# Altium schematic sheet Quasar_ARM_схема.SchDoc
size A4
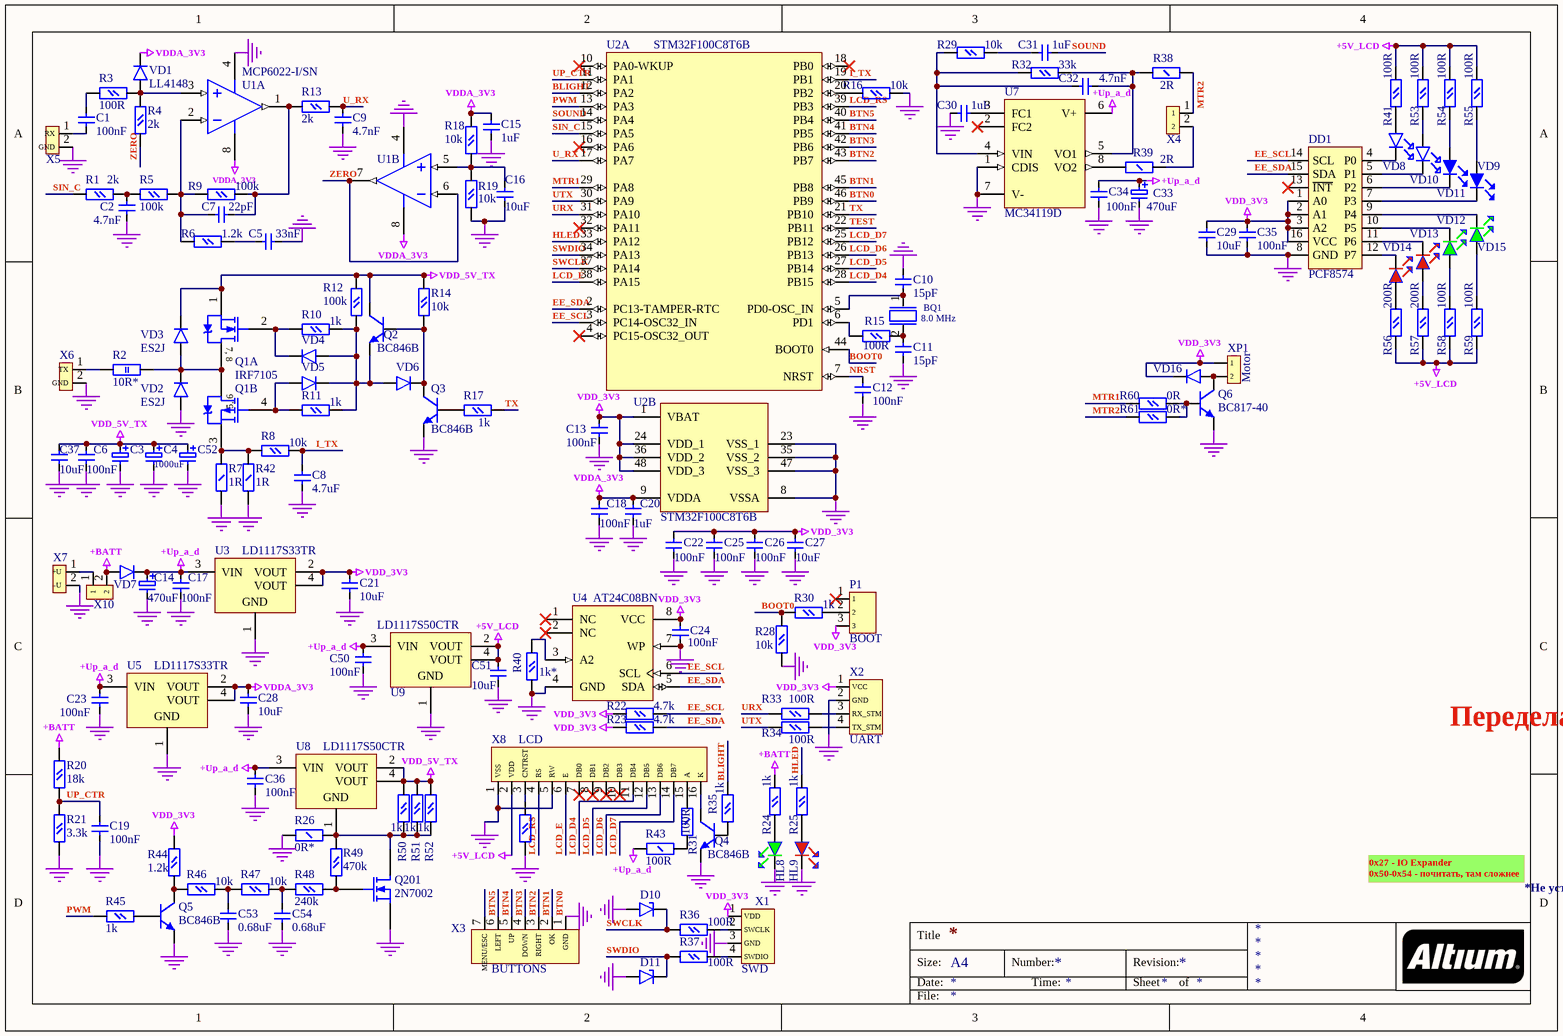
[diagram p0: Quasar_ARM_схема.SchDoc]

## Parts
BQ1  8.0 MHz  [Quartz_SMD_2pin]
C1  100nF  [0603_CAP_0.9_CL10A]
C2  4.7nF  [0603_CAP_0.9_CL10A]
C3  1000uF  [CAP-D]  (value not drawn)
C4  1000uF  [CAP-D]
C5  33nF  [0603_CAP_0.9_CL10A]
C6  100nF  [0603_CAP_0.9_CL10A]
C7  22pF  [0603_CAP_0.9_CL10A]
C8  4.7uF  [0603_CAP_0.9_CL10A]
C9  4.7nF  [0603_CAP_0.9_CL10A]
C10  15pF  [0603_CAP_0.9_CL10A]
C11  15pF  [0603_CAP_0.9_CL10A]
C12  100nF  [0603_CAP_0.9_CL10A]
C13  100nF  [0603_CAP_0.9_CL10A]
C14  470uF  [CAP-D]
C15  1uF  [0603_CAP_0.9_CL10A]
C16  10uF  [1206_C_1.8_CL31B]
C17  100nF  [0603_CAP_0.9_CL10A]
C18  100nF  [0603_CAP_0.9_CL10A]
C19  100nF  [0603_CAP_0.9_CL10A]
C20  1uF  [0603_CAP_0.9_CL10A]
C21  10uF  [1206_C_1.8_CL31B]
C22  100nF  [0603_CAP_0.9_CL10A]
C23  100nF  [0603_CAP_0.9_CL10A]
C24  100nF  [0603_CAP_0.9_CL10A]
C25  100nF  [0603_CAP_0.9_CL10A]
C26  100nF  [0603_CAP_0.9_CL10A]
C27  10uF  [1206_C_1.8_CL31B]
C28  10uF  [1206_C_1.8_CL31B]
C29  10uF  [1206_C_1.8_CL31B]
C30  1uF  [0603_CAP_0.9_CL10A]
C31  1uF  [0603_CAP_0.9_CL10A]
C32  4.7nF  [0603_CAP_0.9_CL10A]
C33  470uF  [CAP-D]
C34  100nF  [0603_CAP_0.9_CL10A]
C35  100nF  [0603_CAP_0.9_CL10A]
C36  100nF  [0603_CAP_0.9_CL10A]
C37  10uF  [1206_C_1.8_CL31B]
C50  100nF  [0603_CAP_0.9_CL10A]
C51  10uF  [1206_C_1.8_CL31B]
C52  1000uF  [CAP-D]  (value not drawn)
C53  0.68uF  [0603_CAP_0.9_CL10A]
C54  0.68uF  [0603_CAP_0.9_CL10A]
D10  BZX384-C5V1  [0402]  (value not drawn)
D11  BZX384-C5V1  [0402]  (value not drawn)
DD1  PCF8574  [SOIC127P1030X265-16N]
HL8  GNL-0603GC  [0603]  (value not drawn)
HL9  KT-SMD0603-R  [1206]  (value not drawn)
P1  BOOT  [3pin(2.54mm)]
Q1  IRF7105  [SO-8_N]  (parts A,B of 2)
Q2  BC846B  [SOT-416]
Q3  BC846B  [SOT-416]
Q4  BC846B  [SOT-416]
Q5  BC846B  [SOT-416]
Q6  BC817-40  [SOT-416]
Q201  2N7002  [SOT23]
R1  2k  [0603_R]
R2  10R*  [R_THT_2W_9x3.2x12.7]
R3  100R  [0603_R]
R4  2k  [0603_R]
R5  100k  [0603_R]
R6  1.2k  [0603_R]
R7  1R  [1206_R]
R8  10k  [0603_R]
R9  100k  [0603_R]
R10  1k  [0603_R]
R11  1k  [0603_R]
R12  100k  [0603_R]
R13  2k  [0603_R]
R14  10k  [0603_R]
R15  100R  [0603_R]
R16  10k  [0603_R]
R17  1k  [0603_R]
R18  10k  [0603_R]
R19  10k  [0603_R]
R20  18k  [0603_R]
R21  3.3k  [0603_R]
R22  4.7k  [0603_R]
R23  4.7k  [0603_R]
R24  1k  [0603_R]
R25  1k  [0603_R]
R26  0R*  [1206_R]
R27  10k-contrast  [0603_R]  (value not drawn)
R28  10k  [0603_R]
R29  10k  [0603_R]
R30  1k  [0603_R]
R31  100R  [1206_R]
R32  33k  [0603_R]
R33  100R  [0603_R]
R34  100R  [0603_R]
R35  1k  [0603_R]
R36  100R  [0603_R]
R37  100R  [0603_R]
R38  2R  [1206_R]
R39  2R  [1206_R]
R40  1k*  [0603_R]
R41  100R  [0603_R]
R42  1R  [1206_R]
R43  100R  [1206_R]
R44  1.2k  [0603_R]
R45  1k  [0603_R]
R46  10k  [0603_R]
R47  10k  [0603_R]
R48  240k  [0603_R]
R49  470k  [0603_R]
R50  1k  [0603_R]
R51  1k  [0603_R]
R52  1k  [0603_R]
R53  100R  [0603_R]
R54  100R  [0603_R]
R55  100R  [0603_R]
R56  200R  [0603_R]
R57  200R  [0603_R]
R58  100R  [0603_R]
R59  100R  [0603_R]
R60  0R  [0603_R]
R61  0R*  [0603_R]
U1  MCP6022-I/SN  [SOIC-SN8_N]  (parts A,B of 2)
U2  STM32F100C8T6B  [LQFP48_N]  (parts A,B of 2)
U3  LD1117S33TR  [SOT-223_N]
U4  AT24C08BN  [8S1_N]
U5  LD1117S33TR  [SOT-223_N]
U7  MC34119D  [751-03_N]
U8  LD1117S50CTR  [SOT-223_N]
U9  LD1117S50CTR  [SOT-223_N]
VD1  LL4148  [SOD-123FL]
VD2  ES2J  [SOD-123FL]
VD3  ES2J  [SOD-123FL]
VD4  LL4148  [SOD-123FL]  (value not drawn)
VD5  LL4148  [SOD-123FL]  (value not drawn)
VD6  LL4148  [SOD-123FL]  (value not drawn)
VD7  PMEG4010BEA  [SOD-123FL]  (value not drawn)
VD8  GNL-5013UWC/60  [LED_DIP_5mm]  (value not drawn)
VD9  GNL-5013UBW-D  [LED_DIP_5mm]  (value not drawn)
VD10  GNL-5013UWC/60  [LED_DIP_5mm]  (value not drawn)
VD11  GNL-5013UBW-D  [LED_DIP_5mm]  (value not drawn)
VD12  GNL-5013PGW-D  [0603]  (value not drawn)
VD13  GNL-5013UEW-D  [1206]  (value not drawn)
VD14  GNL-5013UEW-D  [1206]  (value not drawn)
VD15  GNL-5013PGW-D  [0603]  (value not drawn)
VD16  LL4148  [SOD-123FL]  (value not drawn)
X1  SWD  [4pin(2.54mm)]
X2  UART  [4pin(2.54mm)]
X3  BUTTONS  [7pin(2.54mm)]
X4  *  [2pin(2.54mm)]  (value not drawn)
X5  *  [2pin(2.54mm)]  (value not drawn)
X6  *  [2pin(2.54mm)]  (value not drawn)
X7  *  [2pin(2.54mm)]  (value not drawn)
X8  LCD  [16pin(2.54mm)]
X10  *  [2pin(2.54mm)]  (value not drawn)
XP1  Motor  [2pin(2.54mm)]

## Nets
+5V_LCD: C51.1 R41.2 R53.2 R54.2 R55.2 R56.1 R57.1 R58.1 R59.1 U9.2(VOUT) U9.4(VOUT) X8.2(VDD)
+BATT: R20.2 R24.1 VD7.1(ANODE) X10.2
+Up_a_d: C14.1 C17.1 C23.1 C33.1 C34.1 C36.1 C50.1 R43.2 U3.3(VIN) U5.3(VIN) U7.6(V+) U8.3(VIN) U9.3(VIN) VD7.2(CATODE1)
GND: C2.1 C3.2 C4.2 C5.1 C6.1 C8.2 C9.1 C10.1 C11.2 C12.2 C13.2 C14.2 C15.1 C16.2 C17.2 C18.2 C19.2 C20.1 C21.2 C22.2 C23.2 C24.2 C25.2 C26.2 C27.2 C28.2 C29.2 C30.1 C33.2 C34.2 C35.2 C36.2 C37.2 C50.2 C51.2 C52.2 C53.2 C54.2 D10.2(ANODE) D11.2(ANODE) DD1.8(GND) HL8.2(CATODE1) HL9.2(CATODE1) Q3.2(E) Q4.2(E) Q5.2(E) Q6.2(E) Q201.2(S) R7.2 R16.1 R19.2 R21.1 R26.1 R27.2 R28.2 R40.2 R42.2 U1.4(VSS) U2.8(VSSA) U2.23(VSS_1) U2.35(VSS_2) U2.47(VSS_3) U3.1(GND) U4.4(GND) U4.7(WP) U5.1(GND) U7.1(CDIS) U7.7(V-) U9.1(GND) VD2.1(ANODE) X1.3(GND) X2.2(GND) X3.1(GND) X5.2(GND) X6.2(GND) X7.2(-U) X8.1(VSS) X8.5(RW)
VDD_3V3: C13.1 C21.1 C22.1 C24.1 C25.1 C26.1 C27.1 C29.1 C35.1 DD1.1(A0) DD1.2(A1) DD1.3(A2) DD1.16(VCC) P1.3 R22.2 R23.2 R44.2 U2.1(VBAT) U2.24(VDD_1) U2.36(VDD_2) U2.48(VDD_3) U3.2(VOUT) U3.4(VOUT) U4.8(VCC) VD16.2(CATODE1) X1.1(VDD) X2.1(VCC) XP1.1
VDD_5V_TX: C3.1 C4.1 C6.2 C37.1 C52.1 Q1.1(S1) Q2.3(C) R12.1 R14.1 R50.1 R51.1 R52.1 U8.2(VOUT) U8.4(VOUT) VD3.2(CATODE1)
VDDA_3V3: C15.2 C18.1 C20.2 C28.1 R18.1 U1.8(VDD) U2.9(VDDA) U5.2(VOUT) U5.4(VOUT) VD1.2(CATODE1)
BLIGHT: R35.1 U2.12(PA2)
BOOT0: R28.1 R30.2 U2.44(BOOT0)
BTN0: U2.46(PB9) X3.2(OK)
BTN1: U2.45(PB8) X3.3(RIGHT)
BTN2: U2.43(PB7) X3.4(DOWN)
BTN3: U2.42(PB6) X3.5(UP)
BTN4: U2.41(PB5) X3.6(LEFT)
BTN5: U2.40(PB4) X3.7(MENU/ESC)
EE_SCL: DD1.14(SCL) R22.1 U2.3(PC14-OSC32_IN) U4.6(SCL)
EE_SDA: DD1.15(SDA) R23.1 U2.2(PC13-TAMPER-RTC) U4.5(SDA)
HLED: R25.1 U2.33(PA12)
I_TX: C8.1 R8.1 U2.19(PB1)
LCD_D4: U2.28(PB15) X8.11(DB4)
LCD_D5: U2.27(PB14) X8.12(DB5)
LCD_D6: U2.26(PB13) X8.13(DB6)
LCD_D7: U2.25(PB12) X8.14(DB7)
LCD_E: U2.38(PA15) X8.6(E)
LCD_RS: U2.39(PB3) X8.4(RS)
MTR1: R60.2 U2.29(PA8)
MTR2: R38.2 R61.2 X4.1
NRST: C12.1 U2.7(NRST)
PWM: R45.1 U2.13(PA3)
SIN_C: R1.2 U2.15(PA5)
SOUND: C31.2 U2.14(PA4)
SWCLK: D10.1(CATODE) R36.2 U2.37(PA14)
SWDIO: D11.1(CATODE) R37.2 U2.34(PA13)
TEST: U2.22(PB11)
TX: R17.2 U2.21(PB10)
U_RX: C9.2 R13.2 U2.17(PA7)
UP_CTR: C19.1 R20.1 R21.2 U2.11(PA1)
URX: R33.1 U2.31(PA10)
UTX: R34.2 U2.30(PA9)
ZERO: R4.2 U1.6(VINB-) U1.7(VOUTB)
NetBQ1_1: BQ1.1 C10.2 U2.5(PD0-OSC_IN)
NetBQ1_2: BQ1.2 C11.1 R15.2
NetC1_1: C1.1 R3.2
NetC1_2: C1.2 X5.1(RX)
NetC2_2: C2.2 R1.1 R5.2
NetC5_2: C5.2 R6.2
NetC7_1: C7.1 R5.1 R6.1 R9.2 U1.2(VINA-)
NetC7_2: C7.2 R9.1 R13.1 U1.1(VOUTA)
NetC16_1: C16.1 R18.2 R19.1 U1.5(VINB+)
NetC30_2: C30.2 U7.3(FC1)
NetC31_1: C31.1 R29.2
NetC32_1: C32.1 R29.1 R32.2 U7.4(VIN)
NetC32_2: C32.2 R32.1 R38.1 U7.5(VO1)
NetC53_1: C53.1 R46.2 R47.1
NetC54_1: C54.1 R47.2 R48.2
NetDD1_4: DD1.4(P0) VD8.1(CATODE)
NetDD1_5: DD1.5(P1) VD10.1(CATODE)
NetDD1_6: DD1.6(P2) VD11.1(CATODE)
NetDD1_7: DD1.7(P3) VD9.1(CATODE)
NetDD1_9: DD1.9(P4) VD15.1(CATODE)
NetDD1_10: DD1.10(P5) VD12.1(CATODE)
NetDD1_11: DD1.11(P6) VD13.1(CATODE)
NetDD1_12: DD1.12(P7) VD14.1(CATODE)
NetHL8_1: HL8.1(ANODE) R24.2
NetHL9_1: HL9.1(ANODE) R25.2
NetP1_2: P1.2 R30.1
NetQ1_2: Q1.2(G1) R10.2 VD4.2(CATODE1)
NetQ1_3: Q1.3(S2) R7.1 R8.2 R42.1
NetQ1_4: Q1.4(G2) R11.2 VD5.1(ANODE)
NetQ1_5: Q1.5(D2) Q1.6(D2) Q1.7(D1) Q1.8(D1) R2.2 VD2.2(CATODE1) VD3.1(ANODE)
NetQ2_1: Q2.1(B) Q3.3(C) R14.2 VD6.2(CATODE1)
NetQ2_2: Q2.2(E) R10.1 R11.1 R12.2 VD4.1(ANODE) VD5.2(CATODE1) VD6.1(ANODE)
NetQ3_1: Q3.1(B) R17.1
NetQ4_1: Q4.1(B) R35.2
NetQ4_3: Q4.3(C) X8.16(K)
NetQ5_1: Q5.1(B) R45.2
NetQ5_3: Q5.3(C) R44.1 R46.1
NetQ6_1: Q6.1(B) R60.1 R61.1
NetQ6_3: Q6.3(C) VD16.1(ANODE) XP1.2
NetQ201_1: Q201.1(D) R26.2 R49.1 R50.2 R51.2 R52.2 U8.1(GND)
NetQ201_3: Q201.3(G) R48.1 R49.2
NetR2_1: R2.1 X6.1(TX)
NetR3_1: R3.1 R4.1 U1.3(VINA+) VD1.1(ANODE)
NetR15_1: R15.1 U2.6(PD1)
NetR16_2: R16.2 U2.20(PB2)
NetR27_1: R27.1 X8.3(CNTRST)
NetR31_1: R31.1 X8.15(A)
NetR31_2: R31.2 R43.1
NetR33_2: R33.2 X2.3(RX_STM)
NetR34_1: R34.1 X2.4(TX_STM)
NetR36_1: R36.1 X1.2(SWCLK)
NetR37_1: R37.1 X1.4(SWDIO)
NetR39_1: R39.1 U7.8(VO2)
NetR39_2: R39.2 X4.2
NetR40_1: R40.1 U4.3(A2)
NetR41_1: R41.1 VD8.2(ANODE)
NetR53_1: R53.1 VD10.2(ANODE)
NetR54_1: R54.1 VD11.2(ANODE)
NetR55_1: R55.1 VD9.2(ANODE)
NetR56_2: R56.2 VD14.2(ANODE)
NetR57_2: R57.2 VD13.2(ANODE)
NetR58_2: R58.2 VD12.2(ANODE)
NetR59_2: R59.2 VD15.2(ANODE)
NetX7_1: X7.1(+U) X10.1

Not connected (* = marked no-connect by the designer): DD1 13(~{INT})*; P1 1*; U2 4(PC15-OSC32_OUT)* 10(PA0-WKUP)* 16(PA6)* 18(PB0)* 32(PA11)*; U4 1(NC)* 2(NC)*; U7 2(FC2)*; X8 7(DB0)* 8(DB1)* 9(DB2)* 10(DB3)*

## Notes on the sheet
- Переделать усилители, добавить FM
- 0x27 - IO Expander
  0x50-0x54 - почитать, там сложнее
- *Не устанавливать
- Title
- Size:
- Date:
- A4
- Number:
- Time:
- Revision:
- Sheet
- of
- File:
- (in symbol IRF7105, part A) 7, 8
- (in symbol IRF7105, part B) 5, 6

## Library data of the parts
BQ1 = Quartz_2pin: Name: 49S-SMD 8.0 MHz; Value: 8.0 MHz
C1 C6 C12 C13 C17-C19 C22-C26 C34-C36 C50 = CAP_0603: Capacitor_0603; Name: CL10B104KO8NNNC; Detailed_nominal: 0603-100nF-X7R-16V±10%; Value: 100nF; Type: Capacitor
C2 C9 C32 = CAP_0603: Capacitor_0603; Name: CL10B472KB8NNNC; Detailed_nominal: 0603-4.7nF-X7R-50V±10%; Value: 4.7nF; Type: Capacitor
C3 C4 C52 = CAP_D: Capacitor case D; Detailed_nominal: SMD-D-1000uF-10V±20%; Value: 1000uF; Name: *; Type: Capacitor case D
C5 = CAP_0603: Capacitor_0603; Name: CL10B333KB8WPNC; Detailed_nominal: 0603-33nF-X7R-50V±10%; Value: 33nF; Type: Capacitor
C7 = CAP_0603: Capacitor_0603; Name: CL10C220JB8NFNC; Detailed_nominal: 0603-22pF-NP0-50V±5%; Value: 22pF; Type: Capacitor
C8 = CAP_0603: Capacitor_0603; Name: CL10A475KQ8NNNC; Detailed_nominal: 0603-X5R-4.7uF-6.3V±10%; Value: 4.7uF; Type: Capacitor
C10 C11 = CAP_0603: Capacitor_0603; Name: CL10C150JB8NNNC; Detailed_nominal: 0603-15pF-NP0-50V±5%; Value: 15pF; Type: Capacitor
C14 C33 = CAP_D: Capacitor case D; Detailed_nominal: SMD-D-470uF-16V±20%; Value: 470uF; Name: *; Type: Capacitor case D
C15 C20 C30 C31 = CAP_0603: Capacitor_0603; Name: CL10B105KQ8NNNC; Detailed_nominal: 0603-X7R-1uF-6.3V±10%; Value: 1uF; Type: Capacitor
C16 C21 C27-C29 C37 C51 = CAP_1206: Capacitor_1206; Name: CL31B106KAHNNNE; Detailed_nominal: 1206-10uF-X7R-25V±10%; Value: 10uF; Type: Capacitor
C53 C54 = CAP_0603: Capacitor_0603; Name: CL10B684KO8NFNC; Detailed_nominal: 0603-X7R-0.68uF-16V±10%; Value: 0.68uF; Type: Capacitor
D10 D11 = Diode_Zener1: Diode Zener; Value: BZX384-C5V1; Name: BZX384-C5V1; type: Diode Zener
DD1 = PCF8574: I/O Expander; Name: PCF8574DW(PCF8574AT); Value: PCF8574; Type: I/O Expander 8-bit
HL8 VD12 VD15 = LED_GREEN: 0402-0603-1206
  HL8: Value: GNL-0603GC; Name: GNL-0603GC
  VD12 VD15: Value: GNL-5013PGW-D; Name: GNL-5013PGW-D
HL9 VD13 VD14 = LED_RED: 0402-0603-1206
  HL9: Value: KT-SMD0603-R; Name: KT-SMD0603-R
  VD13 VD14: Value: GNL-5013UEW-D; Name: GNL-5013UEW-D
P1 = Connector - 3 pin_1: Value: BOOT; Name: BOOT
Q1 = IRF7105: HEXFET Power MOSFET; Published: 8-Jun-2000; LatestRevisionDate: 13-Apr-2006; LatestRevisionNote: IPC-7351 Footprint Added.; DatasheetVersion: Nov-1997; PackageVersion: Feb-2001; PackageReference: SO-8; Publisher: Altium Limited; PackageDescription: 8-Pin Plastic Small Outline Integrated Circuit 1.27 mm Pitch; Code_JEDEC: MS-012-AA; Code_IPC: SOIC127P600-8; ComponentLink1Description: Manufacturer Link; ComponentLink1URL: http://www.irf.com/; ComponentLink2Description: Datasheet; ComponentLink2URL: http://www.irf.com/product-info/datasheets/data/irf7105.pdf; Name: IRF7105; Value: IRF7105
Q2-Q6 = Transistor_NPN: NPN General-purpose Transistor; Type: Transistor NPN
  Q2-Q5: Value: BC846B; Name: BC846B
  Q6: Value: BC817-40; Name: BC817-40
Q201 = 2N7002: N-Channel Enhancement Mode Vertical DMOS FET; Published: 8-Jun-2000; LatestRevisionDate: 17-Jul-2002; LatestRevisionNote: Re-released for DXP Platform.; DatasheetVersion: Jan-1996; PackageVersion: 1996; PackageReference: SOT23; Publisher: Altium Limited; PackageDescription: SOT-23; 3 Leads; Body 3.1 x 2.5 mm, inc. leads (LxW max), Alternate Lead Configuration; ComponentLink1Description: Manufacturer Link; ComponentLink1URL: http://www.zetex.com/; Name: 2N7002; Value: 2N7002
R1 R4 R13 = RES_0603_0.125W: 0603; Name: RC0603FR-072KL; Detailed_nominal: 0603-2k±1%-1/16W; Value: 2k; Type: Resistor_1/8W_0603
R2 = RES_THT_2W: Res THT; Name: MFR200SSJTB-10R-Hitano; Detailed_nominal: 9x3.2x12.7-10R±5%-2W; Value: 10R*; Type: Resistor_THT_2W
R3 R15 R33 R34 R36 R37 R41 R53-R55 R58 R59 = RES_0603_0.1W: 0603; Name: RC0603FR-07100RL; Detailed_nominal: 0603-100R±1%-1/10W; Value: 100R; Type: Resistor_1/10W_0603
R5 R9 R12 = RES_0603_0.125W: 0603; Name: RC0603FR-07100KL; Detailed_nominal: 0603-100k±1%-1/16W; Value: 100k; Type: Resistor_1/8W_0603
R6 R44 = RES_0603_0.125W: 0603; Name: RC0603FR-071K2L; Detailed_nominal: 0603-1.2k±1%-1/16W; Value: 1.2k; Type: Resistor_1/8W_0603
R7 R42 = RES_1206_0.25W: 1206; Name: RC1206FR-071RL; Detailed_nominal: 1206-1R±1%-1/4W; Value: 1R; Type: Resistor_1/4W_1206
R8 R14 R16 R18 R19 R27-R29 R46 R47 = RES_0603_0.125W: 0603; Name: RC0603FR-0710KL; Detailed_nominal: 0603-10k±1%-1/16W; Type: Resistor_1/8W_0603
  R8 R14 R16 R18 R19 R28 R29 R46 R47: Value: 10k
  R27: Value: 10k-contrast
R10 R11 R17 R24 R25 R30 R35 R40 R45 R50-R52 = RES_0603_0.125W: 0603; Name: RC0603FR-071KL; Detailed_nominal: 0603-1k±1%-1/8W; Type: Resistor_1/8W_0603
  R10 R11 R17 R24 R25 R30 R35 R45 R50-R52: Value: 1k
  R40: Value: 1k*
R20 = RES_0603_0.125W: 0603; Name: RC0603FR-0718KL; Detailed_nominal: 0603-18k±1%-1/8W; Value: 18k; Type: Resistor_1/8W_0603
R21 = RES_0603_0.125W: 0603; Name: RC0603FR-133K3L; Detailed_nominal: 0603-3.3k±1%-1/8W; Value: 3.3k; Type: Resistor_1/8W_0603
R22 R23 = RES_0603_0.125W: 0603; Name: RC0603FR-074K7L; Detailed_nominal: 0603-4.7k±1%-1/8W; Value: 4.7k; Type: Resistor_1/8W_0603
R26 = RES_1206_0.25W: 1206; Name: RC1206FR-070RL; Detailed_nominal: 1206-0R-1/4W; Value: 0R*; Type: Resistor_1/4W_1206
R31 R43 = RES_1206_0.25W: 1206; Name: RC1206JR-100R-Hitano; Detailed_nominal: 1206-100R±1%-1/4W; Value: 100R; Type: Resistor_1/4W_1206
R32 = RES_0603_0.125W: 0603; Name: RC0603FR-0733KL; Detailed_nominal: 0603-33k±1%-1/8W; Value: 33k; Type: Resistor_1/8W_0603
R38 R39 = RES_1206_0.25W: 1206; Name: RC1206JR-072RL; Detailed_nominal: 1206-2R±1%-1/4W; Value: 2R; Type: Resistor_1/4W_1206
R48 = RES_0603_0.125W: 0603; Name: RC0603FR-07240KL; Detailed_nominal: 0603-240k±1%-1/8W; Value: 240k; Type: Resistor_1/8W_0603
R49 = RES_0603_0.125W: 0603; Name: RC0603FR-07470KL; Detailed_nominal: 0603-470k±1%-1/8W; Value: 470k; Type: Resistor_1/8W_0603
R56 R57 = RES_0603_0.1W: 0603; Detailed_nominal: 0603-200R±5%-1/10W; Value: 200R; Name: *; Type: Resistor_1/10W_0603
R60 R61 = RES_0603_0.1W: 0603; Name: RC0603FR-070RL; Detailed_nominal: 0603-0R-1/10W; Type: Resistor_1/10W_0603
  R60: Value: 0R
  R61: Value: 0R*
U1 = MCP6022-I/SN: Rail-to-Rail Input/Output, 10 MHz Operational Amplifier, 8-Pin SOIC, Industrial Temperature; Published: 29-Jan-2009; LatestRevisionDate: 02-Dec-2009; LatestRevisionNote: Updated to datasheet revision D, Feb-2009; DatasheetVersion: revD, Feb-2009; PackageVersion: revBB, Aug-2009; PackageReference: SOIC-SN8; Publisher: Altium Limited; PackageDescription: 8-Lead Plastic Small Outline (SN) - Narrow, 3.90mm Body [SOIC]; Supplier 1: Digi-Key; Supplier Part Number 1: MCP6022-I/SN-ND; Supplier 2: Farnell; Supplier Part Number 2: 1439415; Code_JEDEC: MS-012; Code_IPC: SOIC127P600-8; ComponentLink1Description: Datasheet; ComponentLink1URL: http://ww1.microchip.com/downloads/en/DeviceDoc/21685d.pdf; ComponentLink2Description: Packaging Specification; ComponentLink2URL: http://www.microchip.com/stellent/groups/techpub_sg/documents/packagingspec/en012702.pdf; ComponentLink3Description: Microchip.com Home; ComponentLink3URL: http://www.microchip.com/; Name: MCP6022-I/SN; Value: MCP6022-I/SN
U2 = STM32F100C8T6B: STM32 ARM-based 32-bit MCU Value Line with 64 kB Flash, 8 kB Internal RAM, Internal Code B, -40 to +85°C Temperature, 48-Pin LQFP, Tray; DatasheetVersion: rev6.0, Apr-2011; PackageVersion: rev13, Apr-2011; PackageReference: LQFP48; PackageDescription: 48-Pin Low-Profile Quad Flat Pack, 7 x 7 mm Body, 0.5 mm Pitch (LQFP48); ComponentLink1Description: Manufacturer URL; ComponentLink1URL: http://www.st.com/; ComponentLink2Description: STM32F100 Datasheet; ComponentLink2URL: http://www.st.com/internet/com/TECHNICAL_RESOURCES/TECHNICAL_LITERATURE/DATASHEET/CD00251732.pdf; ComponentLink3Description: STM32 Family Web Page; ComponentLink3URL: www.st.com/stm32; Name: STM32F100C8T6B; Value: STM32F100C8T6B
U3 U5 = LD1117S33TR: Fixed Low Drop Positive Voltage Regulator, 3.3V, 4-Pin SOT-223, Tape and Reel; DatasheetVersion: Nov-2011; PackageVersion: 2010; PackageReference: SOT-223; PackageDescription: 4-Pin SOT-223 Package, 6.5 x 3.5 mm Body, 2.3 mm Pitch, 7 mm Lead Span; PartNumber: LD1117S33TR; ComponentLink1Description: Manufacturer URL; ComponentLink1URL: http://www.st.com; ComponentLink2Description: Datasheet; ComponentLink2URL: http://www.st.com/internet/com/TECHNICAL_RESOURCES/TECHNICAL_LITERATURE/DATASHEET/CD00000544.pdf; Name: LD1117S33TR; Value: LD1117S33TR
U4 = AT24C08BN-SP25-B: 8Kbit (1024 x 8), 2-wire Bus Automotive Serial EEPROM with Write Protect, 2.5V, 8-Pin SOIC, Bulk; Published: 20-Sep-2010; DatasheetVersion: 8517C,  Jan-2009; PackageVersion: revC, Mar-2005; PackageReference: 8S1; Publisher: Altium Limited; PackageDescription: 8-Lead (0.150" Wide Body), Plastic Gull Wing Small Outline (JEDEC SOIC); Code_JEDEC: MS-012-AA; Code_IPC: SOIC127P600-8; ComponentLink1Description: Manufacturer Link; ComponentLink1URL: http://www.atmel.com/products/serial/default.asp; ComponentLink2Description: Datasheet; ComponentLink2URL: http://www.atmel.com/dyn/resources/prod_documents/doc8517.pdf; ComponentLink3Description: Atmel.com Home; ComponentLink3URL: http://www.atmel.com; Name: AT24C08BN-SP25-B; Value: AT24C08BN
U7 = MC34119D: Low-Power Audio Amplifier; Published: 17-Jul-2002; LatestRevisionDate: 13-Apr-2006; LatestRevisionNote: IPC-7351 Footprint Added.; DatasheetVersion: 1989; PackageReference: 751-03; Publisher: Altium Limited; PackageDescription: 8-Pin Small Outline Integrated Circuit 1.27 mm Pitch; Code_JEDEC: MS-012-AA; Code_IPC: SOIC127P600-8; Name: MC34119D; Value: MC34119D
U8 U9 = LD1117S50CTR: Fixed Low Drop Positive Voltage Regulator, 5V, 4-Pin SOT-223, Tape and Reel; DatasheetVersion: Nov-2011; PackageVersion: 2010; PackageReference: SOT-223; PackageDescription: 4-Pin SOT-223 Package, 6.5 x 3.5 mm Body, 2.3 mm Pitch, 7 mm Lead Span; PartNumber: LD1117S50CTR; ComponentLink1Description: Manufacturer URL; ComponentLink1URL: http://www.st.com; ComponentLink2Description: Datasheet; ComponentLink2URL: http://www.st.com/internet/com/TECHNICAL_RESOURCES/TECHNICAL_LITERATURE/DATASHEET/CD00000544.pdf; Name: LD1117S50CTR; Value: LD1117S50CTR
VD1-VD7 VD16 = Diode1: Type: Diode
  VD1 VD4-VD6 VD16: Value: LL4148; Name: LL4148
  VD2 VD3: Value: ES2J; Name: ES2J
  VD7: Value: PMEG4010BEA; Name: PMEG4010BEA
VD8 VD10 = LED_WHITE: 0402-0603-1206; Value: GNL-5013UWC/60; Name: GNL-5013UWC/60
VD9 VD11 = LED_BLUE: 0402-0603-1206; Value: GNL-5013UBW-D; Name: GNL-5013UBW-D
X1 X2 = Connector - 4 pin_1
  X1: Value: SWD; Name: SWD
  X2: Value: UART; Name: UART
X3 = Connector - 7 pin: Value: BUTTONS; Name: BUTTONS; Type: Connector 7 pin
X4-X7 X10 = Connector - 2 pin_1: Connector 2-pin; Value: *; Name: *; Type: Connector 2-pin
X8 = Connector - 16 pin: Value: LCD; Name: LCD; Type: Connector 16 pin
XP1 = Connector - 2 pin_1: Connector 2-pin; Name: 104121, 107234 (RKS); Value: Motor; Type: Connector 2-pin